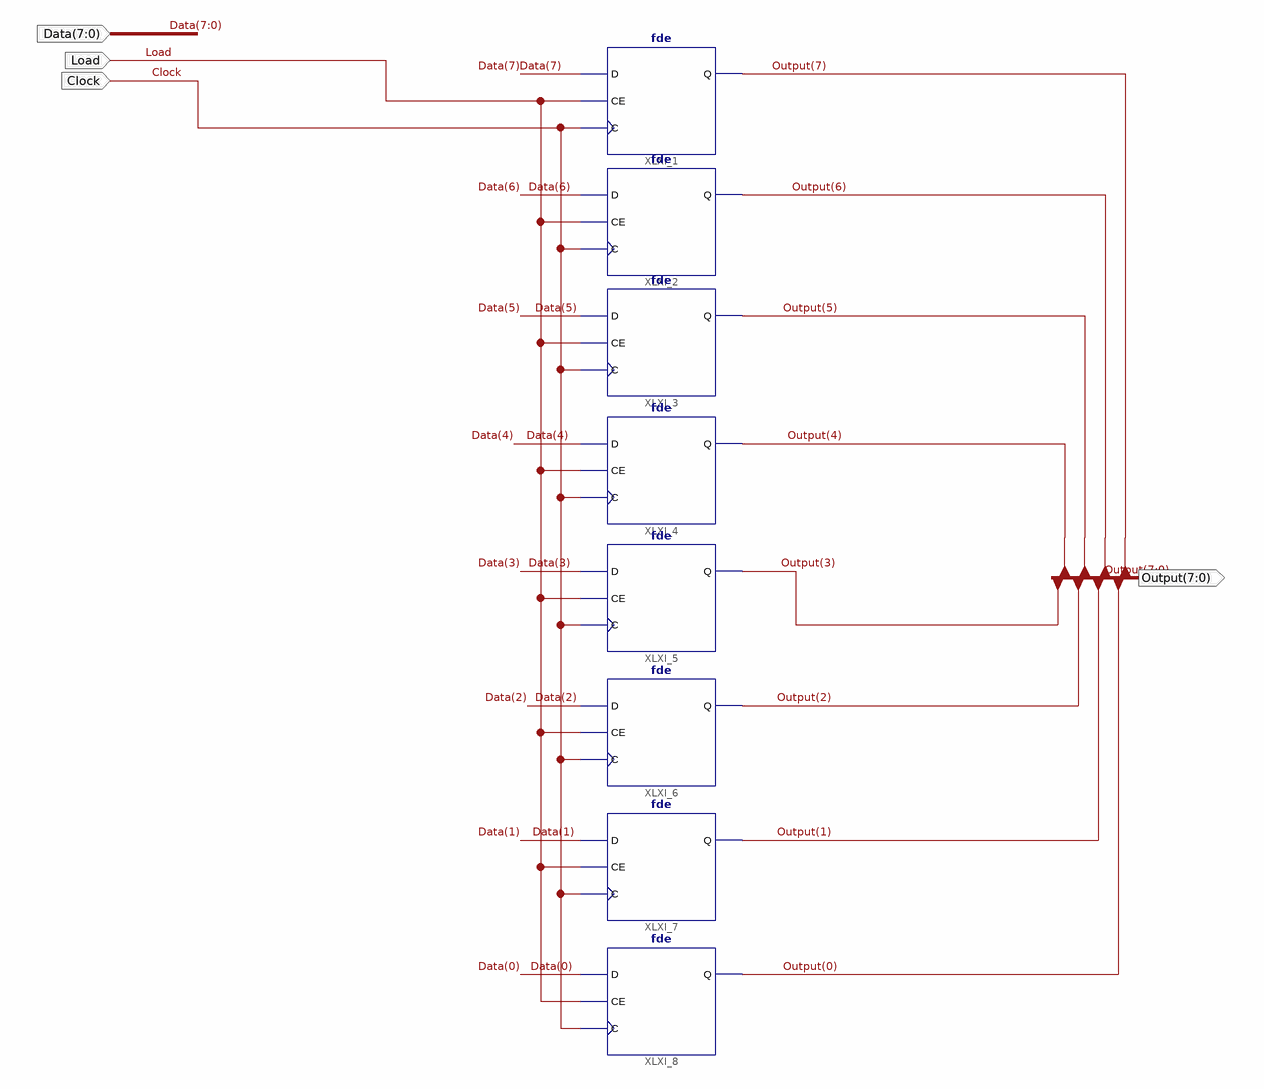
[diagram p0: schematic sheet 1]
// Xilinx ISE schematic proj2reg8to8.sch (spartan6) as structural Verilog: 8 symbols, 4 ports
module proj2reg8to8 (
  input  [7:0] Data,
  input  Load,
  input  Clock,
  output [7:0] Output
);

  fde XLXI_1 (.C(Clock), .CE(Load), .D(Data[7]), .Q(Output[7]));
  fde XLXI_2 (.C(Clock), .CE(Load), .D(Data[6]), .Q(Output[6]));
  fde XLXI_3 (.C(Clock), .CE(Load), .D(Data[5]), .Q(Output[5]));
  fde XLXI_4 (.C(Clock), .CE(Load), .D(Data[4]), .Q(Output[4]));
  fde XLXI_5 (.C(Clock), .CE(Load), .D(Data[3]), .Q(Output[3]));
  fde XLXI_6 (.C(Clock), .CE(Load), .D(Data[2]), .Q(Output[2]));
  fde XLXI_7 (.C(Clock), .CE(Load), .D(Data[1]), .Q(Output[1]));
  fde XLXI_8 (.C(Clock), .CE(Load), .D(Data[0]), .Q(Output[0]));
endmodule
